# EAGLE design Xmas (EAGLE 7.2.0)
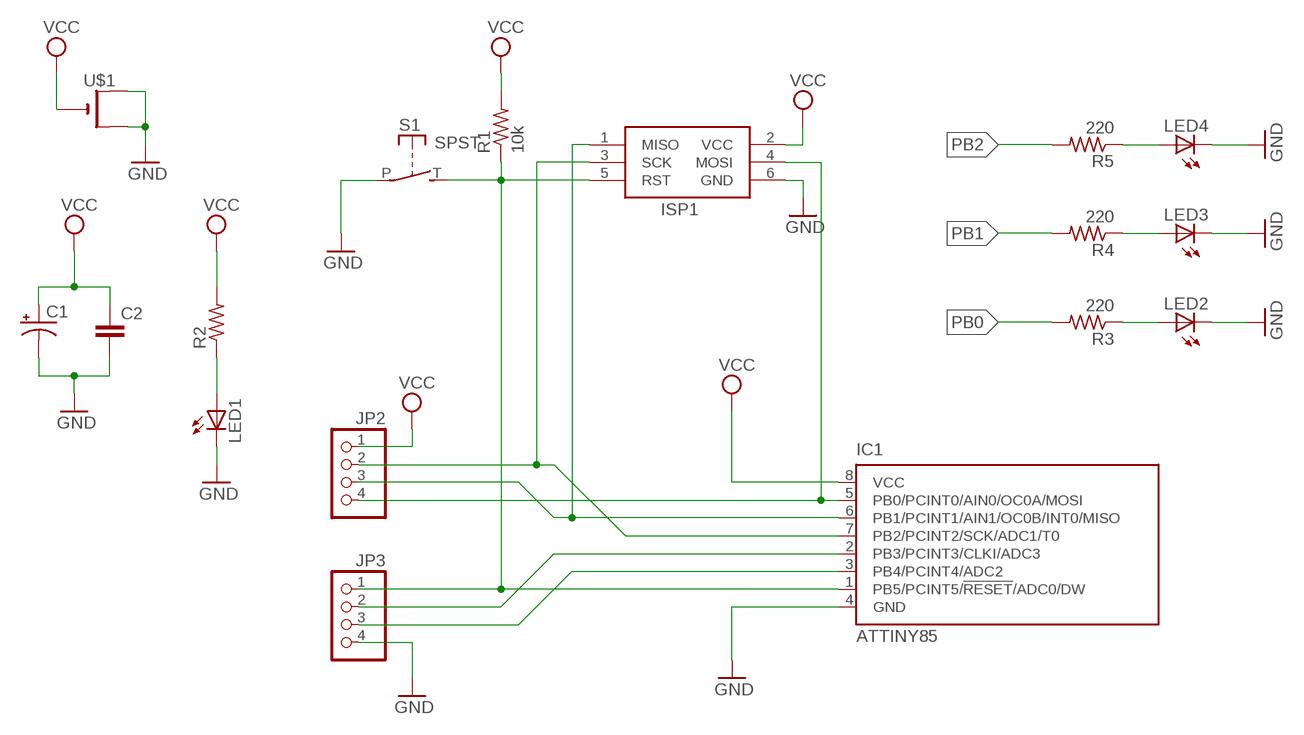
[diagram p0: schematic, sheet 1]

## Parts
C1  100UF-25V-20%(PTH)  [CPOL-RADIAL-100UF-25V]
C2  0.1UF-50V-20%(PTH)KIT-EZ  [CAP-PTH-SMALL-KIT]
IC1  ATTINY85  TINY13-20PU  [DIL08]
ISP1  AVRISP-6  [AVRISP]
JP2  PINHD-1X4  [1X04]
JP3  PINHD-1X4  [1X04]
LED1  LED3MM  [LED3MM]
LED2  LED3MM  [LED3MM]
LED3  LED3MM  [LED3MM]
LED4  LED3MM  [LED3MM]
R1  10k  R-US_0207/9  [0207/9]
R2  R-US_0207/9  [0207/9]
R3  220  R-US_0207/9  [0207/9]
R4  220  R-US_0207/9  [0207/9]
R5  220  R-US_0207/9  [0207/9]
S1  SPST  [JUDCOSPST]
U$1  CR1220THM  [CR1220-THM]

## Nets
GND: C1.2(-) C2.2 IC1.4(GND) ISP1.6(GND) JP3.4 LED1.K(C) LED2.K(C) LED3.K(C) LED4.K(C) S1.P U$1.+1(+) U$1.+2(+1)
N$1: LED1.A R2.1
N$2: LED2.A R3.1
N$3: LED3.A R4.1
N$4: LED4.A R5.1
PB0: IC1.5(PB0/PCINT0/AIN0/OC0A/MOSI) ISP1.4(MOSI) JP2.4 R3.2
PB1: IC1.6(PB1/PCINT1/AIN1/OC0B/INT0/MISO) ISP1.1(MISO) JP2.3 R4.2
PB2: IC1.7(PB2/PCINT2/SCK/ADC1/T0) ISP1.3(SCK) JP2.2 R5.2
PB3: IC1.2(PB3/PCINT3/CLKI/ADC3) JP3.2
PB4: IC1.3(PB4/PCINT4/ADC2) JP3.3
PB5: IC1.1(PB5/PCINT5/!RESET!/ADC0/DW) ISP1.5(RST) JP3.1 R1.1 S1.T(S)
VCC: C1.1(+) C2.1 IC1.8(VCC) ISP1.2(VCC) JP2.1 R1.2 R2.2 U$1.-

## Library data of the parts
C1 = SparkFun-Capacitors:100UF-25V-20%(PTH): CAP-08439; PROD_ID: CAP-08439
C2 = SparkFun-Capacitors:0.1UF-50V-20%(PTH): CAP-08370; PROD_ID: CAP-08370
IC1 = atmel:TINY13: 8-bit AVR Microcontroller with 1K Bytes In-System Programmable Flash Source: http://www.atmel.com/dyn/resources/prod_documents/2535S.pdf; MPN: ATTINY13-20PU; OC_FARNELL: 9171550; OC_NEWARK: 96K6521
ISP1 = adafruit:AVRISP: AVR ISP HEADER Standard 6 pin header for AVR programming
JP2 JP3 = pinhead:PINHD-1X4: PIN HEADER
LED1-LED4 = adafruit:LED: LED OSRAM: - CHIPLED LG R971, LG N971, LY N971, LG Q971, LY Q971, LO R971, LY R971 LH N974, LH R974 LS Q976, LO Q976, LY Q976 LO Q996 - Hyper CHIPLED LW Q18S LB Q993, LB Q99A, LB R99A - SideLED LS A670, LO A670, LY A670, LG A670, LP A670 LB A673, LV A673, LT A673, LW A673 LH A674 LY A675 LS A676, LA A676, LO A676, LY A676, LW A676 LS A679, LY A679, LG A679 - Hyper Micro SIDELED® LS Y876, LA Y876, LO Y876, LY Y876 LT Y87S - SmartLED LW L88C, LW L88S LB L89C, LB L89S, LG L890 LS L89K, LO L89K, LY L89K LS L896, LA L896, LO L896, LY L896 - TOPLED LS T670, LO T670, LY T670, LG T670, LP T670 LSG T670, LSP T670, LSY T670, LOP T670, LYG T670 LG T671, LOG T671, LSG T671 LB T673, LV T673, LT T673, LW T673 LH T674 LS T676, LA T676, LO T676, LY T676, LB T676, LH T676, LSB T676, LW T676 LB T67C, LV T67C, LT T67C, LS T67K, LO T67K, LY T67K, LW E67C LS E67B, LA E67B, LO E67B, LY E67B, LB E67C, LV E67C, LT E67C LW T67C LS T679, LY T679, LG T679 LS T770, LO T770, LY T770, LG T770, LP T770 LB T773, LV T773, LT T773, LW T773 LH T774 LS E675, LA E675, LY E675, LS T675 LS T776, LA T776, LO T776, LY T776, LB T776 LHGB T686 LT T68C, LB T68C - Hyper Mini TOPLED® LB M676 - Mini TOPLED Santana® LG M470 LS M47K, LO M47K, LY M47K Source: http://www.osram.convergy.de/
R1-R5 = adafruit:R-US_: RESISTOR, American symbol
S1 = adafruit:SPST: Judco 50-0015-00
U$1 = adafruit:CR1220: CR1216/CR1220/CR1225 12mm 3V lithium coin cell Great for battery packup. Both SMT and THM holders. Note the THM package has the ground pads on both sides of the PCB so that the masks are the same - this reduces the cost

## Net classes
0 default: width 0.305 mm, drill 0.508 mm, clearance 0.254 mm

## Board
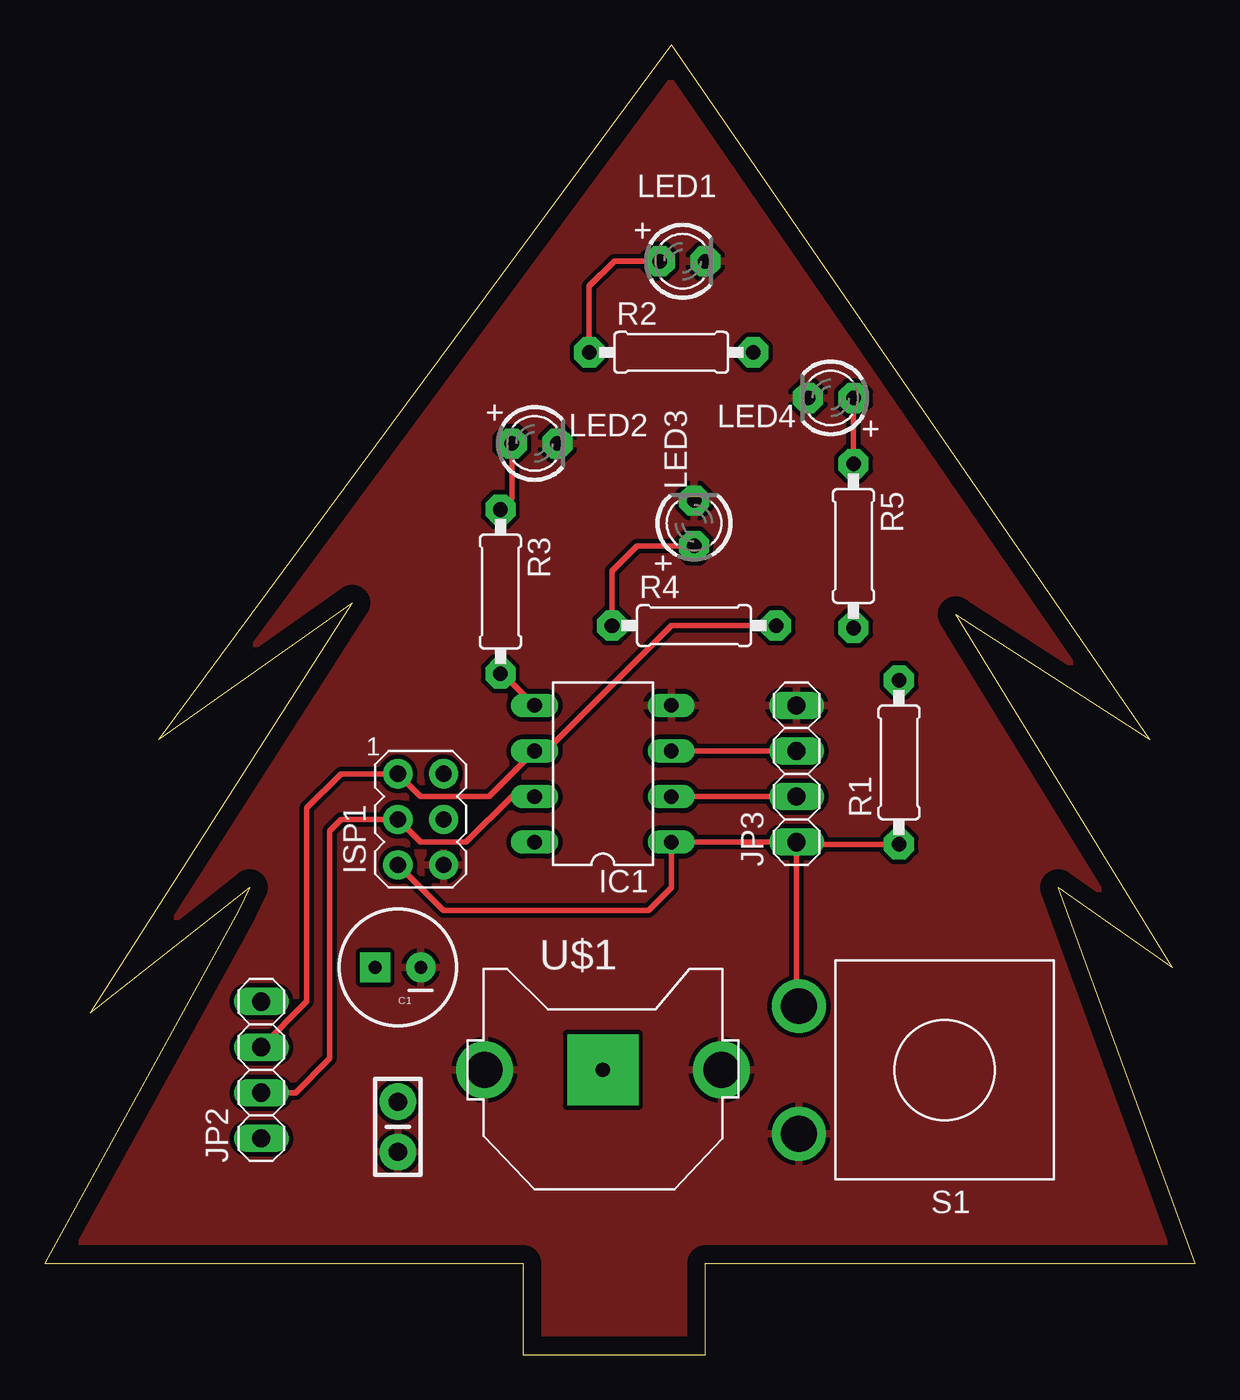
[diagram p1: board, top side]
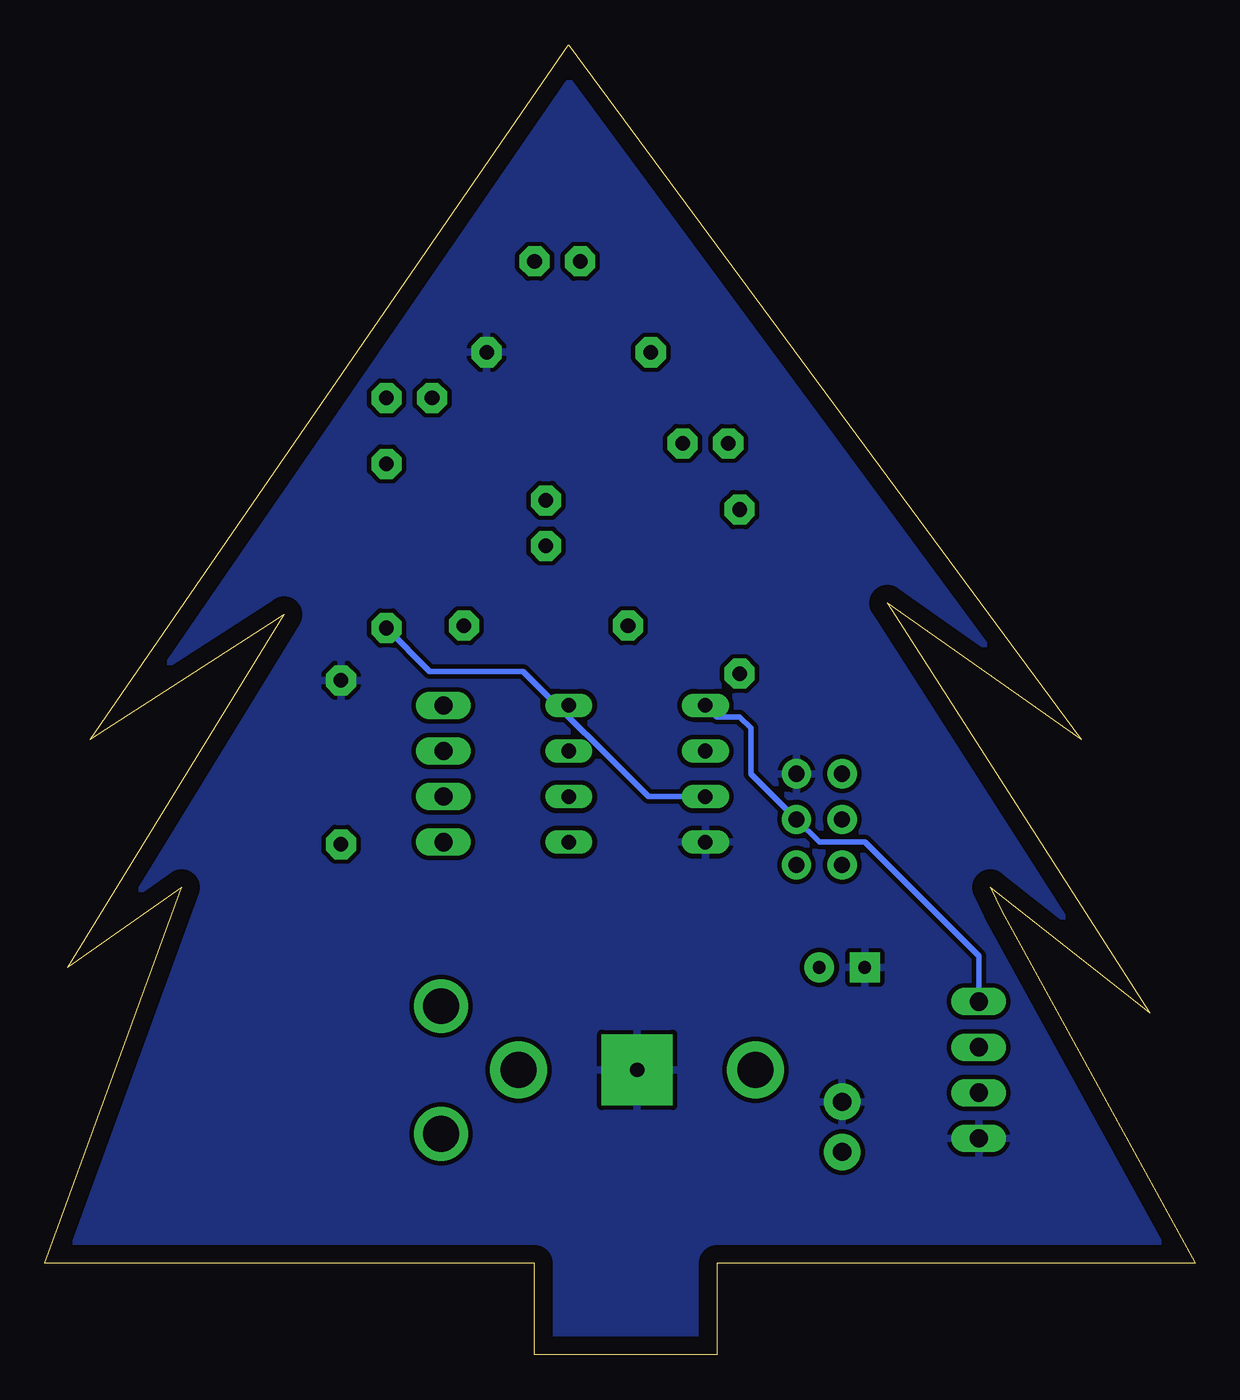
[diagram p2: board, bottom side, seen from below]

Size 64.14 x 73.02 mm. Coordinates in mm from the lower left corner, seen from the top.
Outline: 34.92,73.02 6.35,34.29 17.14,41.91 2.54,19.05 11.43,26.04 10.79,24.76 0,5.08 26.67,5.08 26.67,0 36.83,0 36.83,5.08 64.14,5.08 56.51,26.04 62.87,21.59 50.8,41.27 61.59,34.29 34.92,73.02
Copper layers (1*16): Top 0.035mm / dielectric 1.5mm / Bottom 0.035mm
Design rules "default": minimum track width 10mil, minimum drill 24mil, track to track 8mil, track to pad 8mil, pad to pad 8mil, via to via 8mil, smd to smd 8mil, copper to edge 40mil, drill to drill 8mil, minimum pad ring 10mil, minimum via ring 8mil, stop-mask expansion 4mil, vias tented up to drill 0mil, thermal gap 10mil

### Footprints (pad centres in the part's own frame; a part is rotated, then mirrored left to right if it is on the bottom)
CPOL-RADIAL-100UF-25V = drill 0.7 pad 1.651 square: 1 1.27,0 | drill 0.7 pad 1.651: 2 -1.27,0
CAP-PTH-SMALL-KIT = drill 1.016 pad 2.032: 1 -1.397,0; 2 1.397,0
DIL08 = drill 0.813 long: 1 -3.81,-3.81; 2 -1.27,-3.81; 3 1.27,-3.81; 4 3.81,-3.81; 5 3.81,3.81; 6 1.27,3.81; 7 -1.27,3.81; 8 -3.81,3.81
AVRISP = drill 0.9 pad 1.626: 1 -1.27,2.54; 2 1.27,2.54; 3 -1.27,0; 4 1.27,0; 5 -1.27,-2.54; 6 1.27,-2.54
1X04 = drill 1.016 long: 1 -3.81,0; 2 -1.27,0; 3 1.27,0; 4 3.81,0
LED3MM = drill 0.813 pad 1.676 octagon: A -1.27,0; K 1.27,0
0207/9 = drill 0.813 pad 1.676 octagon: 1 -4.572,0; 2 4.572,0
JUDCOSPST = drill 2: P 3.556,-8.128; T -3.556,-8.128
CR1220-THM = drill 2 pad 3.175: +1 -6.604,0; +2 6.604,0 | drill 0.8 pad 3.962 square: - 0,0

### Placement (x,y rotation side)
C1  19.68,21.59 180 top
C2  19.68,12.7 270 top
IC1  31.11,32.39 90 top
ISP1  20.96,29.84 0 top
JP2  12.07,15.88 90 top
JP3  41.91,32.39 90 top
LED1  35.56,60.96 0 top
LED2  27.3,50.8 0 top
LED3  36.2,46.36 90 top
LED4  43.81,53.34 180 top
R1  47.62,33.02 90 top
R2  34.92,55.88 0 top
R3  25.4,42.55 270 top
R4  36.2,40.64 0 top
R5  45.08,45.09 270 top
S1  50.16,15.88 270 top
U$1  31.11,15.88 0 top

### Tracks (layer width: path | path; a pad name or v marks a point on that pad's centre or on a via)
GND
  pour Top: -1.27,74.3 -1.27,-0.64 66.04,-0.64 66.04,74.3
N$1
  Top 0.305: R2.1 30.35,59.56 31.75,60.96 LED1.A
N$2
  Top 0.305: LED2.A 26.04,47.75 R3.1
N$3
  Top 0.305: R4.1 31.62,43.69 33.02,45.09 LED3.A
N$4
  Top 0.305: LED4.A R5.1
PB0
  Top 0.305: R3.2 25.53,37.97 IC1.5
  Bottom 0.305: IC1.5 26.67,35.56 25.4,35.56 24.77,34.93 24.77,32.39 ISP1.4 20.96,28.57 18.41,28.57 12.07,22.22 JP2.4
PB1
  Top 0.305: R4.2 34.92,40.64 27.94,33.66 IC1.6 24.77,31.11 20.96,31.11 ISP1.1 16.51,32.39 14.61,30.48 14.61,19.68 JP2.3
PB2
  Top 0.305: IC1.7 26.04,31.11 23.5,28.57 20.96,28.57 ISP1.3 16.51,29.84 15.88,29.21 15.88,16.51 13.97,14.61 JP2.2
  Bottom 0.305: IC1.7 30.48,31.11 37.46,38.1 42.67,38.1 R5.2
PB3
  Top 0.305: IC1.2 JP3.2
PB4
  Top 0.305: JP3.3 IC1.3
PB5
  Top 0.305: JP3.1 IC1.1 34.92,26.04 33.65,24.76 22.23,24.76 ISP1.5 | R1.1 42.04,28.45 JP3.1 | JP3.1 41.91,19.56 S1.T
VCC
  pour Bottom: -1.27,74.93 -1.91,-1.91 66.67,-1.27 66.67,74.93